# Altium project Startracker_mainboard.PrjPcb
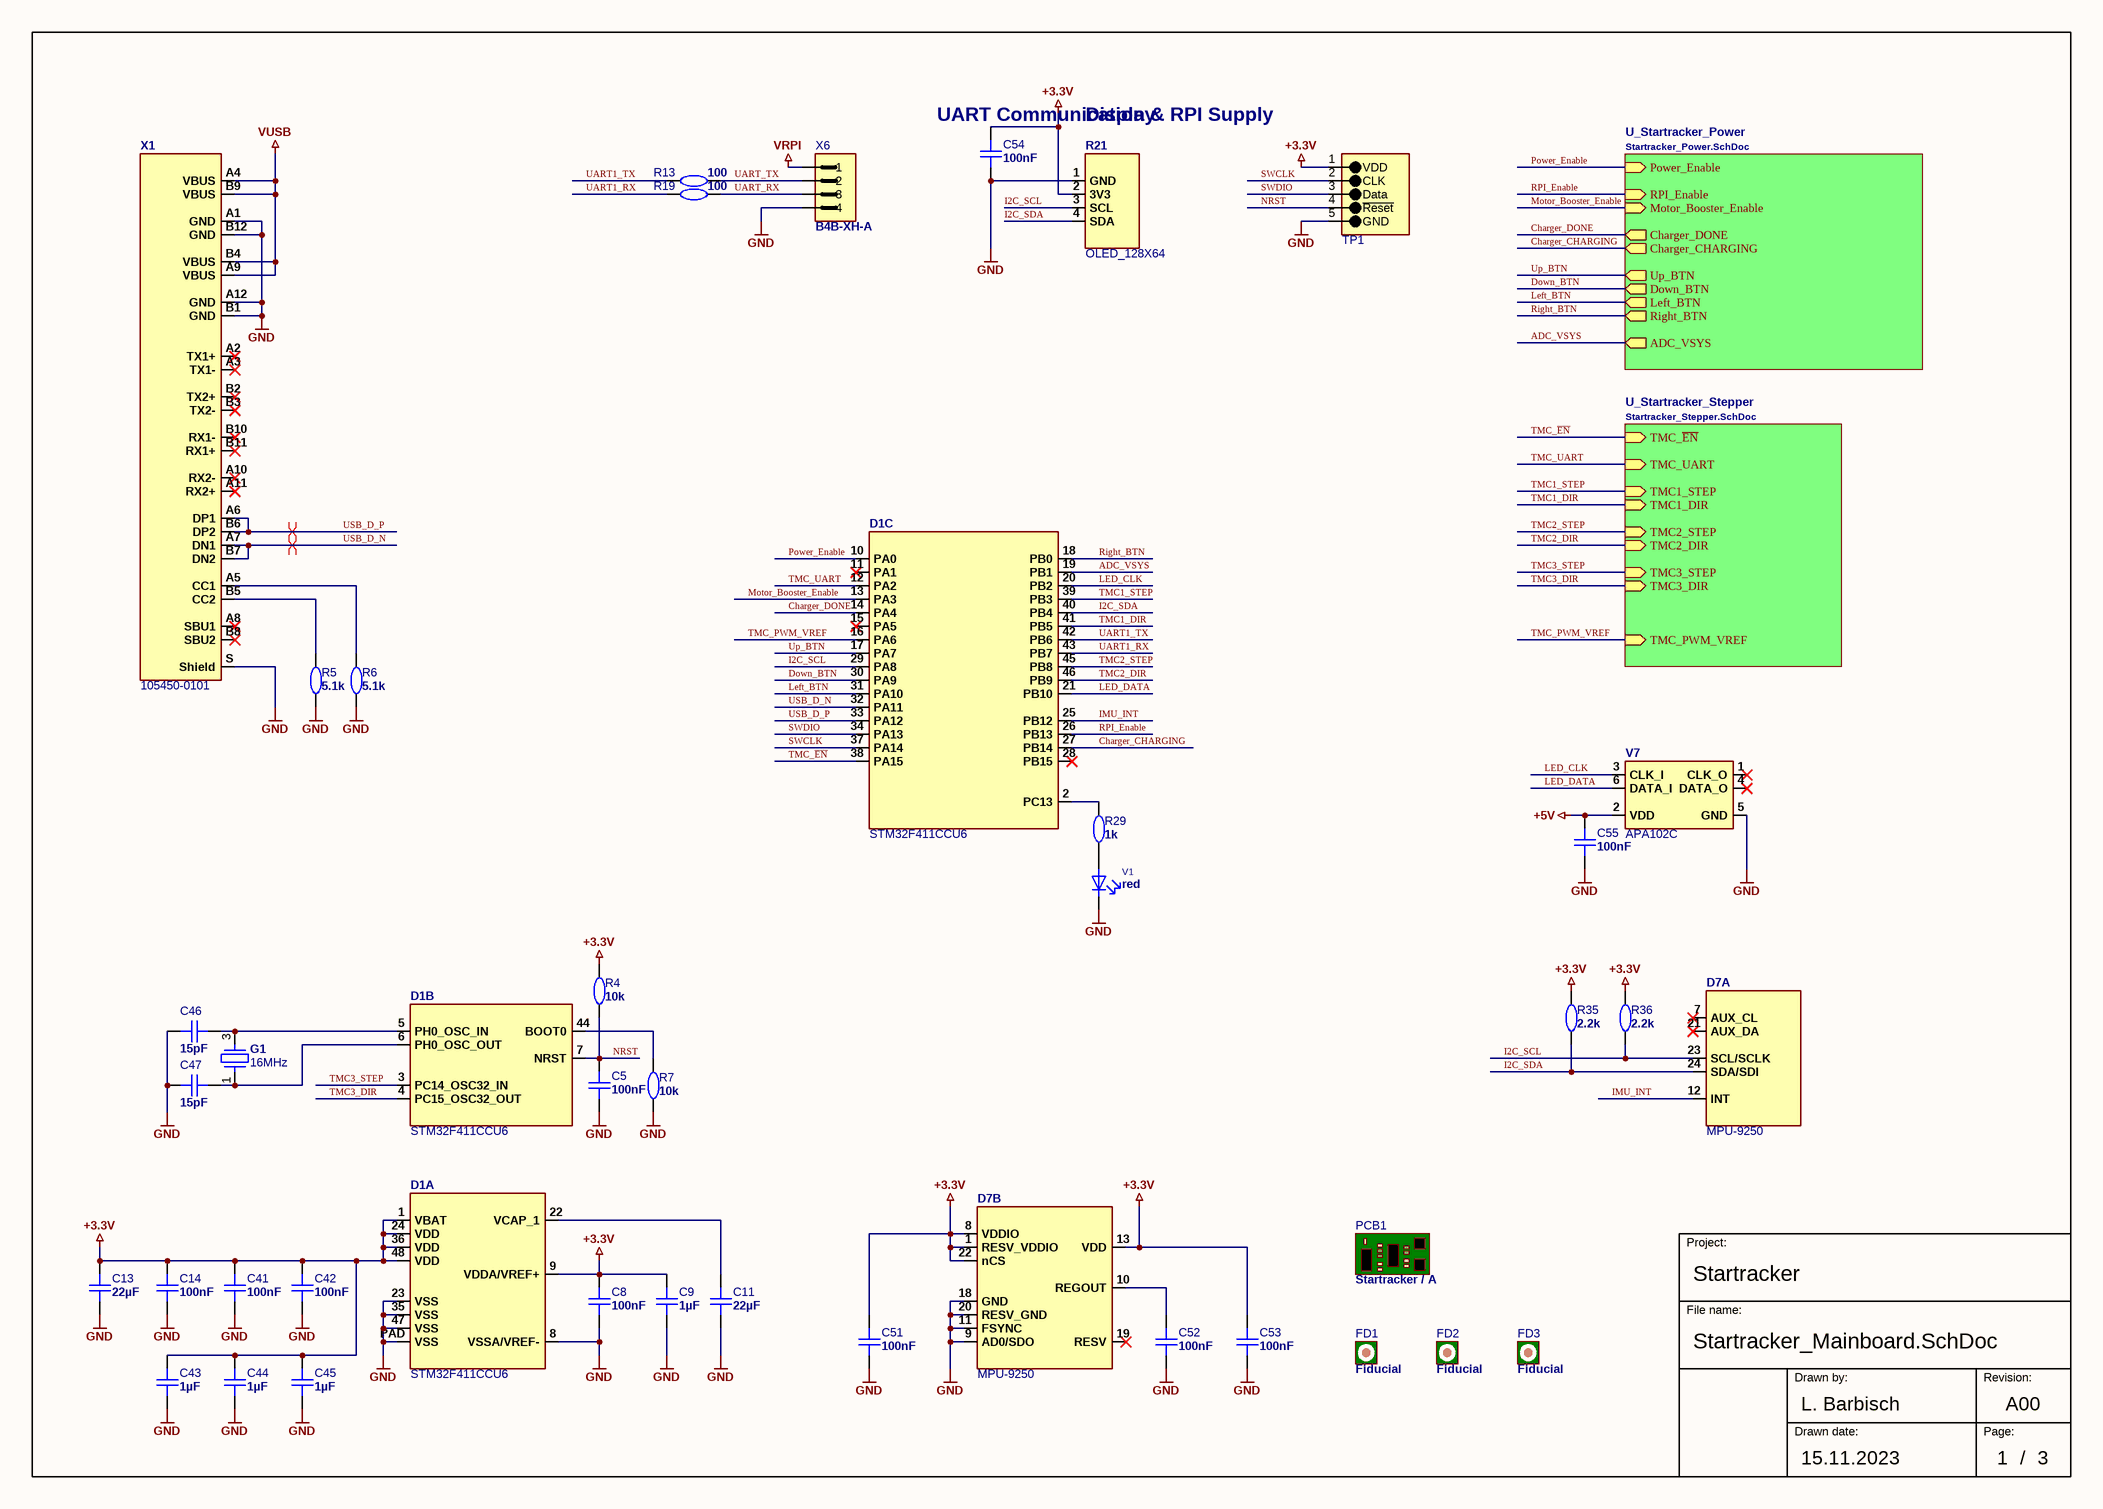
[diagram p0: Startracker_Mainboard.SchDoc]
Schematic_Title: Startracker; Schematic_Revision: A00; Schematic_DrawnDate: 15.11.2023; Schematic_DrawnBy: L. Barbisch; Schematic_DocumentNo: XXXXXXXX; Schematic_CheckedDate: 15.11.2023; Schematic_CheckedBy: L. Barbisch; Revision: A00; Project: Startracker; PCB_TP_Revision: A; PCB_TP_DocumentNo: XXXXXXXX; PCB_Title: Startracker; PCB_Revision: A; PCB_PartNo: XXX.XXXX; PCB_DrawnDate: 15.11.2023; PCB_DrawnBy: L. Barbisch; PCB_CheckedDate: 15.11.2023; PCB_CheckedBy: L. Barbisch; PCB_Assy_DrawnDate: 15.11.2023; PCB_Assy_DrawnBy: L. Barbisch
3 sheets, 126 parts. Net scope: hierarchical (ports join the sheet entries above them; power ports are global).
Board file: Startracker_mainboard.PcbDoc
Sheets:
  Startracker_Mainboard.SchDoc
    U_Startracker_Power = Startracker_Power.SchDoc
    U_Startracker_Stepper = Startracker_Stepper.SchDoc

## Sheet Startracker_Mainboard.SchDoc
size A3; SheetNumber: 1; SheetTotal: 3

### Parts
C5  value 100nF  [C-0603_1608_095_L_RF]  (hidden comment: Cap 100n 0603)
C8  value 100nF  [C-0603_1608_095_L_RF]  (hidden comment: Cap 100n 0603)
C9  value 1µF  [C-0603_1608_095_L_RF]  (hidden comment: Cap 1u 0603)
C11  value 22µF  [C-0603_1608_110_L_RF]  (hidden comment: Cap 22u/ 6.3V 0603)
C13  value 22µF  [C-0603_1608_110_L_RF]  (hidden comment: Cap 22u/ 6.3V 0603)
C14  value 100nF  [C-0603_1608_095_L_RF]  (hidden comment: Cap 100n 0603)
C41  value 100nF  [C-0603_1608_095_L_RF]  (hidden comment: Cap 100n 0603)
C42  value 100nF  [C-0603_1608_095_L_RF]  (hidden comment: Cap 100n 0603)
C43  value 1µF  [C-0603_1608_095_L_RF]  (hidden comment: Cap 1u 0603)
C44  value 1µF  [C-0603_1608_095_L_RF]  (hidden comment: Cap 1u 0603)
C45  value 1µF  [C-0603_1608_095_L_RF]  (hidden comment: Cap 1u 0603)
C46  value 15pF  [C-0603_1608_095_L_RF]  (hidden comment: Cap 15p 0603)
C47  value 15pF  [C-0603_1608_095_L_RF]  (hidden comment: Cap 15p 0603)
C51  value 100nF  [C-0603_1608_095_L_RF]  (hidden comment: Cap 100n 0603)
C52  value 100nF  [C-0603_1608_095_L_RF]  (hidden comment: Cap 100n 0603)
C53  value 100nF  [C-0603_1608_095_L_RF]  (hidden comment: Cap 100n 0603)
C54  value 100nF  [C-0603_1608_095_L_RF]  (hidden comment: Cap 100n 0603)
C55  value 100nF  [C-0603_1608_095_L_RF]  (hidden comment: Cap 100n 0603)
D1  STM32F411CCU6  [UFQFPN48_N_RF]  (parts A,B,C of 3)
D7  MPU-9250  [QFN24_N_RF]  (parts A,B of 2)
FD1  Fiducial  [Fiducial_1.0mm]  (no BOM)
FD2  Fiducial  [Fiducial_1.0mm]  (no BOM)
FD3  Fiducial  [Fiducial_1.0mm]  (no BOM)
G1  16MHz  [G_3225_N_RF]
PCB1  value Startracker / A  [Dummy_PCB-Parameter_SM]  (hidden comment: PCB_Dummy)
R4  value 10k  [R-0603_1608_050_L_RF]  (hidden comment: Res 10k 0603)
R5  value 5.1k  [R-0603_1608_050_L_RF]  (hidden comment: Res 5k1 0603)
R6  value 5.1k  [R-0603_1608_050_L_RF]  (hidden comment: Res 5k1 0603)
R7  value 10k  [R-0603_1608_050_L_RF]  (hidden comment: Res 10k 0603)
R13  value 100  [R-0603_1608_050_L_RF]  (hidden comment: Res 100R 0603)
R19  value 100  [R-0603_1608_050_L_RF]  (hidden comment: Res 100R 0603)
R21  OLED_128X64  [OLED_0.96]
R29  value 1k  [R-0603_1608_050_L_RF]  (hidden comment: Res 1k 0603)
R35  value 2.2k  [R-0603_1608_050_L_RF]  (hidden comment: Res 2k2 0603)
R36  value 2.2k  [R-0603_1608_050_L_RF]  (hidden comment: Res 2k2 0603)
TP1  Programming Interface 5P  [TP_ProgrammingInterface_5P_A]  (value not drawn)  (no BOM)
V1  value red  [LED-0603_1608_Red_L_RF]  (hidden comment: LED SMD 0603 Red)
V7  APA102C  [V_2020_P6_N_RF]
X1  105450-0101  [105450-0101]
X6  value B4B-XH-A  [X-0124X0057-R_M04_P0250_JST_B4B-XH-A]  (hidden comment: CONN HEADER XH 4POS THT)

### Sub-sheets
U_Startracker_Power = Startracker_Power.SchDoc: Motor_Booster_Enable (in), Power_Enable (in), RPI_Enable (in), Charger_CHARGING (out), Charger_DONE (out), Up_BTN (out), Left_BTN (out), Right_BTN (out), ADC_VSYS (out), Down_BTN (out)
U_Startracker_Stepper = Startracker_Stepper.SchDoc: TMC_~{EN} (in), TMC1_STEP (in), TMC1_DIR (in), TMC2_STEP (in), TMC2_DIR (in), TMC3_STEP (in), TMC3_DIR (in), TMC_PWM_VREF (in), TMC_UART (in)

### Nets
+3.3V: C8.1 C9.2 C13.2 C14.1 C41.1 C42.1 C43.2 C44.2 C45.2 C51.1 C53.1 C54.1 D1.1(VBAT) D1.9(VDDA/VREF+) D1.24(VDD) D1.36(VDD) D1.48(VDD) D7.1(RESV_VDDIO) D7.8(VDDIO) D7.13(VDD) D7.22(nCS) R4.2 R21.2(3V3) R35.1 R36.1 TP1.1(VDD)
+5V: C55.1 V7.2(VDD)
GND: C5.2 C8.2 C9.1 C11.1 C13.1 C14.2 C41.2 C42.2 C43.1 C44.1 C45.1 C46.2 C47.2 C51.2 C52.2 C53.2 C54.2 C55.2 D1.8(VSSA/VREF-) D1.23(VSS) D1.35(VSS) D1.47(VSS) D1.PAD(VSS) D7.9(AD0/SDO) D7.11(FSYNC) D7.18(GND) D7.20(RESV_GND) R5.1 R6.1 R7.1 R21.1(GND) TP1.5(GND) V1.2 V7.5(GND) X1.A1(GND) X1.A12(GND) X1.B1(GND) X1.B12(GND) X1.S(Shield) X6.4
VRPI: X6.1
VUSB: X1.A4(VBUS) X1.A9(VBUS) X1.B4(VBUS) X1.B9(VBUS)
ADC_VSYS: D1.19(PB1) ; sheet U_Startracker_Power/ADC_VSYS
Charger_CHARGING: D1.27(PB14) ; sheet U_Startracker_Power/Charger_CHARGING
Charger_DONE: D1.14(PA4) ; sheet U_Startracker_Power/Charger_DONE
Down_BTN: D1.30(PA9) ; sheet U_Startracker_Power/Down_BTN
I2C_SCL: D1.29(PA8) D7.23(SCL/SCLK) R21.3(SCL) R36.2
I2C_SDA: D1.40(PB4) D7.24(SDA/SDI) R21.4(SDA) R35.2
IMU_INT: D1.25(PB12) D7.12(INT)
LED_CLK: D1.20(PB2) V7.3(CLK_I)
LED_DATA: D1.21(PB10) V7.6(DATA_I)
Left_BTN: D1.31(PA10) ; sheet U_Startracker_Power/Left_BTN
Motor_Booster_Enable: D1.13(PA3) ; sheet U_Startracker_Power/Motor_Booster_Enable
NRST: C5.1 D1.7(NRST) R4.1 TP1.4(~{Reset})
Power_Enable: D1.10(PA0) ; sheet U_Startracker_Power/Power_Enable
Right_BTN: D1.18(PB0) ; sheet U_Startracker_Power/Right_BTN
RPI_Enable: D1.26(PB13) ; sheet U_Startracker_Power/RPI_Enable
SWCLK: D1.37(PA14) TP1.2(CLK)
SWDIO: D1.34(PA13) TP1.3(Data)
TMC1_DIR: D1.41(PB5) ; sheet U_Startracker_Stepper/TMC1_DIR
TMC1_STEP: D1.39(PB3) ; sheet U_Startracker_Stepper/TMC1_STEP
TMC2_DIR: D1.46(PB9) ; sheet U_Startracker_Stepper/TMC2_DIR
TMC2_STEP: D1.45(PB8) ; sheet U_Startracker_Stepper/TMC2_STEP
TMC3_DIR: D1.4(PC15_OSC32_OUT) ; sheet U_Startracker_Stepper/TMC3_DIR
TMC3_STEP: D1.3(PC14_OSC32_IN) ; sheet U_Startracker_Stepper/TMC3_STEP
TMC_~{EN}: D1.38(PA15) ; sheet U_Startracker_Stepper/TMC_~{EN}
TMC_PWM_VREF: D1.16(PA6) ; sheet U_Startracker_Stepper/TMC_PWM_VREF
TMC_UART: D1.12(PA2) ; sheet U_Startracker_Stepper/TMC_UART
UART1_RX: D1.43(PB7) R19.1
UART1_TX: D1.42(PB6) R13.1
UART_RX: R19.2 X6.3
UART_TX: R13.2 X6.2
Up_BTN: D1.17(PA7) ; sheet U_Startracker_Power/Up_BTN
USB_D_N: D1.32(PA11) X1.A7(DN1) X1.B7(DN2)
USB_D_P: D1.33(PA12) X1.A6(DP1) X1.B6(DP2)
NetC11_2: C11.2 D1.22(VCAP_1)
NetC46_1: C46.1 D1.5(PH0_OSC_IN) G1.3
NetC47_1: C47.1 D1.6(PH0_OSC_OUT) G1.1
NetC52_1: C52.1 D7.10(REGOUT)
NetD1_2: D1.2(PC13) R29.2
NetD1_44: D1.44(BOOT0) R7.2
NetR5_2: R5.2 X1.B5(CC2)
NetR6_2: R6.2 X1.A5(CC1)
NetR29_1: R29.1 V1.1

Not connected (* = marked no-connect by the designer): D1 11(PA1)* 15(PA5)* 28(PB15)*; D7 7(AUX_CL)* 19(RESV)* 21(AUX_DA)*; V7 1(CLK_O)* 4(DATA_O)*; X1 A2(TX1+)* A3(TX1-)* A8(SBU1)* A10(RX2-)* A11(RX2+)* B2(TX2+)* B3(TX2-)* B8(SBU2)* B10(RX1-)* B11(RX1+)*

### Layout directives
differential pair; differential pair class USB: USB_D_N, USB_D_P

### Notes on the sheet
- UART Communication & RPI Supply
- Display
- Project:
- File name:
- Drawn by:
- Revision:
- Drawn date:
- Page:
- /

### Library data of the parts
C5 C8 C14 C41 C42 C51-C55 = CMP-001-0037-3: Cap Cer SMD 100n 50V 10% 0603 X7R; Manufacturer: KEMET; Manufacturer Part Number: C0603C104K5RAC; User: epph; Prefered: true; MNL_Number: 22310507; GPV_Number: 1749.0075; Case / Package: 0603; PartStatus: Release; Technology: SMT; ClassName: Surface_Assy
C9 C43-C45 = CMP-001-0045-2: Cap Cer SMD 1u 16V 10% 0603 X7R; Manufacturer Part Number: 0603YC105KAT*; Manufacturer: AVX; Prefered: true; User: zupa; GPV_Number: 1749.0125; MNL_Number: 22310613; ComponentLink1Description: Datasheet; ClassName: Surface_Assy; PartStatus: Release; Case / Package: 0603; ComponentLink1URL: https://datasheet.ciiva.com/11464/ccog-11464569.pdf; Technology: SMT
C11 C13 = CMP-001-0140-2: Cap Cer SMD 22u 6.3V 20% 0603 X5R; Manufacturer Part Number: C1608X5R0J226M080AC; Manufacturer: TDK; Prefered: false; GPV_Number: 1749.0255; User: zupa; PartStatus: Release; Technology: SMT; ComponentLink1Description: Datasheet; ComponentLink1URL: https://datasheet.ciiva.com/24454/c1608x5r0j226m080ac-24454269.pdf; ClassName: Surface_Assy; Case / Package: 0603
C46 C47 = CMP-001-0043-2: Cap Cer SMD 15p 50V 5% 0603 C0G; Manufacturer: AVX; Manufacturer Part Number: 06035A150JAT*; Prefered: true; User: zupa; GPV_Number: 1749.0057; Case / Package: 0603; ClassName: Surface_Assy; PartStatus: Release; Technology: SMT; ComponentLink1Description: Datasheet; ComponentLink1URL: https://datasheet.ciiva.com/11464/ccog-11464569.pdf
D1 = STM32F411CCU6: IC MCU Cortex-M4 256k Flash 128k RAM; Part_validated: No; Manufacturer: ST Microelectronics; GPV_Number: xxxx.xxxx; MNL_Number: xxxxxxxx; Value: STM32F411CCU6; Footprint_validated: No; PartStatus: New; System: -; ClassName: Surface_Assy; Case/Package: UFQFPN48; Technology: SMT; Manufacturer Part Number: STM32F411CCU6
D7 = MPU-9250: IC IMU 9-Axis Attitude Sensor; Part_validated: No; Manufacturer: InvenSense; GPV_Number: xxxx.xxxx; MNL_Number: xxxxxxxx; Value: MPU-9250; Footprint_validated: No; PartStatus: New; System: -; ClassName: Surface_Assy; Case/Package: QFN24; Technology: SMT; Manufacturer Part Number: MPU-9250
FD1-FD3 = CMP-001-1312-3: Fiducial Mark; User: balu; PartStatus: Release; Value: Fiducial; ClassName: Symbol; Technology: SYM
G1 = X322516MMB4SI: Crystal Oscillator 16MHz 10pF ±10ppm LCSC C112972; Part_validated: No; Manufacturer: Yangwing Tech; GPV_Number: xxxx.xxxx; MNL_Number: xxxxxxxx; Value: 16MHz; Footprint_validated: No; PartStatus: New; System: -; ClassName: Surface_Assy; Case/Package: 2532; Technology: SMT; Manufacturer Part Number: X322516MMB4SI
PCB1 = CMP-001-1147-5: <PCB DesignName Revision>; User: balu; GPV_Number: XXX.XXXX; ClassName: Symbol; Technology: SYM; PartStatus: Release
R4 R7 = CMP-001-0241-3: Res SMD 10k 1% 0.1W 0603; Manufacturer: YAGEO; Manufacturer Part Number: RC0603FR-0710KL; MNL_Number: 15310022; GPV_Number: 1922.0100; User: zupa; Prefered: true; Case / Package: 0603; ClassName: Surface_Assy; PartStatus: Release; ComponentLink1URL: https://datasheet.ciiva.com/11808/0900766b80f96399-11808280.pdf; ComponentLink1Description: Datasheet; Technology: SMT
R5 R6 = CMP-001-0582-3: Res SMD 5k1 1% 0.1W 0603; Manufacturer Part Number: RC0603FR-075K1L; Manufacturer: YAGEO; Prefered: true; GPV_Number: 1922.0144; User: napa; Technology: SMT; ComponentLink1URL: https://datasheet.ciiva.com/8895/pyu-rc0603-51-rohs-l-4-8895189.pdf; PartStatus: Release; ClassName: Surface_Assy; ComponentLink1Description: Datasheet; Case / Package: 0603
R13 R19 = CMP-001-0240-3: Res SMD 100R 1% 0.1W 0603; Manufacturer: YAGEO; Manufacturer Part Number: RC0603FR-07100RL; Prefered: true; User: zupa; MNL_Number: 15310004; GPV_Number: 1922.0102; ClassName: Surface_Assy; Case / Package: 0603; ComponentLink1Description: Datasheet; Technology: SMT; ComponentLink1URL: https://datasheet.ciiva.com/11808/0900766b80f96399-11808280.pdf; PartStatus: Release
R21 = Display_0.96: OLED Display I2C 128X64 0.96"; Part_validated: No; GPV_Number: xxxx.xxxx; MNL_Number: xxxxxxxx; Value: OLED_128X64; Footprint_validated: No; PartStatus: New; System: -; Case/Package: 4SIL; Technology: TMT; Manufacturer: *; Manufacturer Part Number: *; ClassName: Through-Hole_Assy
R29 = CMP-001-0250-3: Res SMD 1k 1% 0.1W 0603; Manufacturer: YAGEO; Manufacturer Part Number: RC0603FR-071KL; MNL_Number: 15310012; User: zupa; GPV_Number: 1922.0011; Prefered: true; Technology: SMT; ComponentLink1Description: Datasheet; ClassName: Surface_Assy; ComponentLink1URL: https://datasheet.ciiva.com/11808/0900766b80f96399-11808280.pdf; Case / Package: 0603; PartStatus: Release
R35 R36 = CMP-001-0261-3: Res SMD 2k2 1% 0.1W 0603; Manufacturer: YAGEO; Manufacturer Part Number: RC0603FR-072K2L; Prefered: true; User: zupa; GPV_Number: 1922.1472; ClassName: Surface_Assy; ComponentLink1Description: Datasheet; PartStatus: Release; ComponentLink1URL: https://datasheet.ciiva.com/11808/0900766b80f96399-11808280.pdf; Case / Package: 0603; Technology: SMT
TP1 = CMP-001-1519-1: User: zupa; Value: TP; System: Connector; GPV_Number: -; Technology: SMT; ClassName: Surface_Assy; PartStatus: Release
V1 = CMP-001-1207-6: LED RED LTST-C190KDKT-10A 0603; Manufacturer: Lite-On Inc; GPV_Number: 1602.0727; User: epph; Technology: SMT; Manufacturer Part Number: LTST-C190KDKT-10A; Case / Package: 0603; ClassName: Surface_Assy; PartStatus: Release
V7 = APA102C: RGB LED SPI Interface; Part_validated: No; Manufacturer: APA Electronic CO; Manufacturer Part Number: APA-102-2020-256-8A; GPV_Number: xxxx.xxxx; MNL_Number: xxxxxxxx; Value: APA102C; Footprint_validated: No; PartStatus: New; System: -; ClassName: Surface_Assy; Case/Package: 2020; Technology: SMT
X1 = 105450-0101: CONN USB-C 16pin; Part_validated: No; Manufacturer: Molex; GPV_Number: xxxx.xxxx; System: Connector; MNL_Number: xxxxxxxx; Value: 105450-0101; Footprint_validated: No; PartStatus: New; ClassName: Through-Hole_Assy; Case/Package: USB-C; Technology: SMT; Manufacturer Part Number: 105450-0101
X6 = CMP-00142-3: CONN HEADER  4POS_JST_B4B-XH; Manufacturer: JST; System: Connector; User: balu; GPV_Number: 4401.1048; ClassName: Through-Hole_Assy; Technology: THT; Manufacturer Part Number: B4B-XH-A; PartStatus: Release

## Sheet Startracker_Power.SchDoc
size A3; SheetNumber: 2; SheetTotal: 3
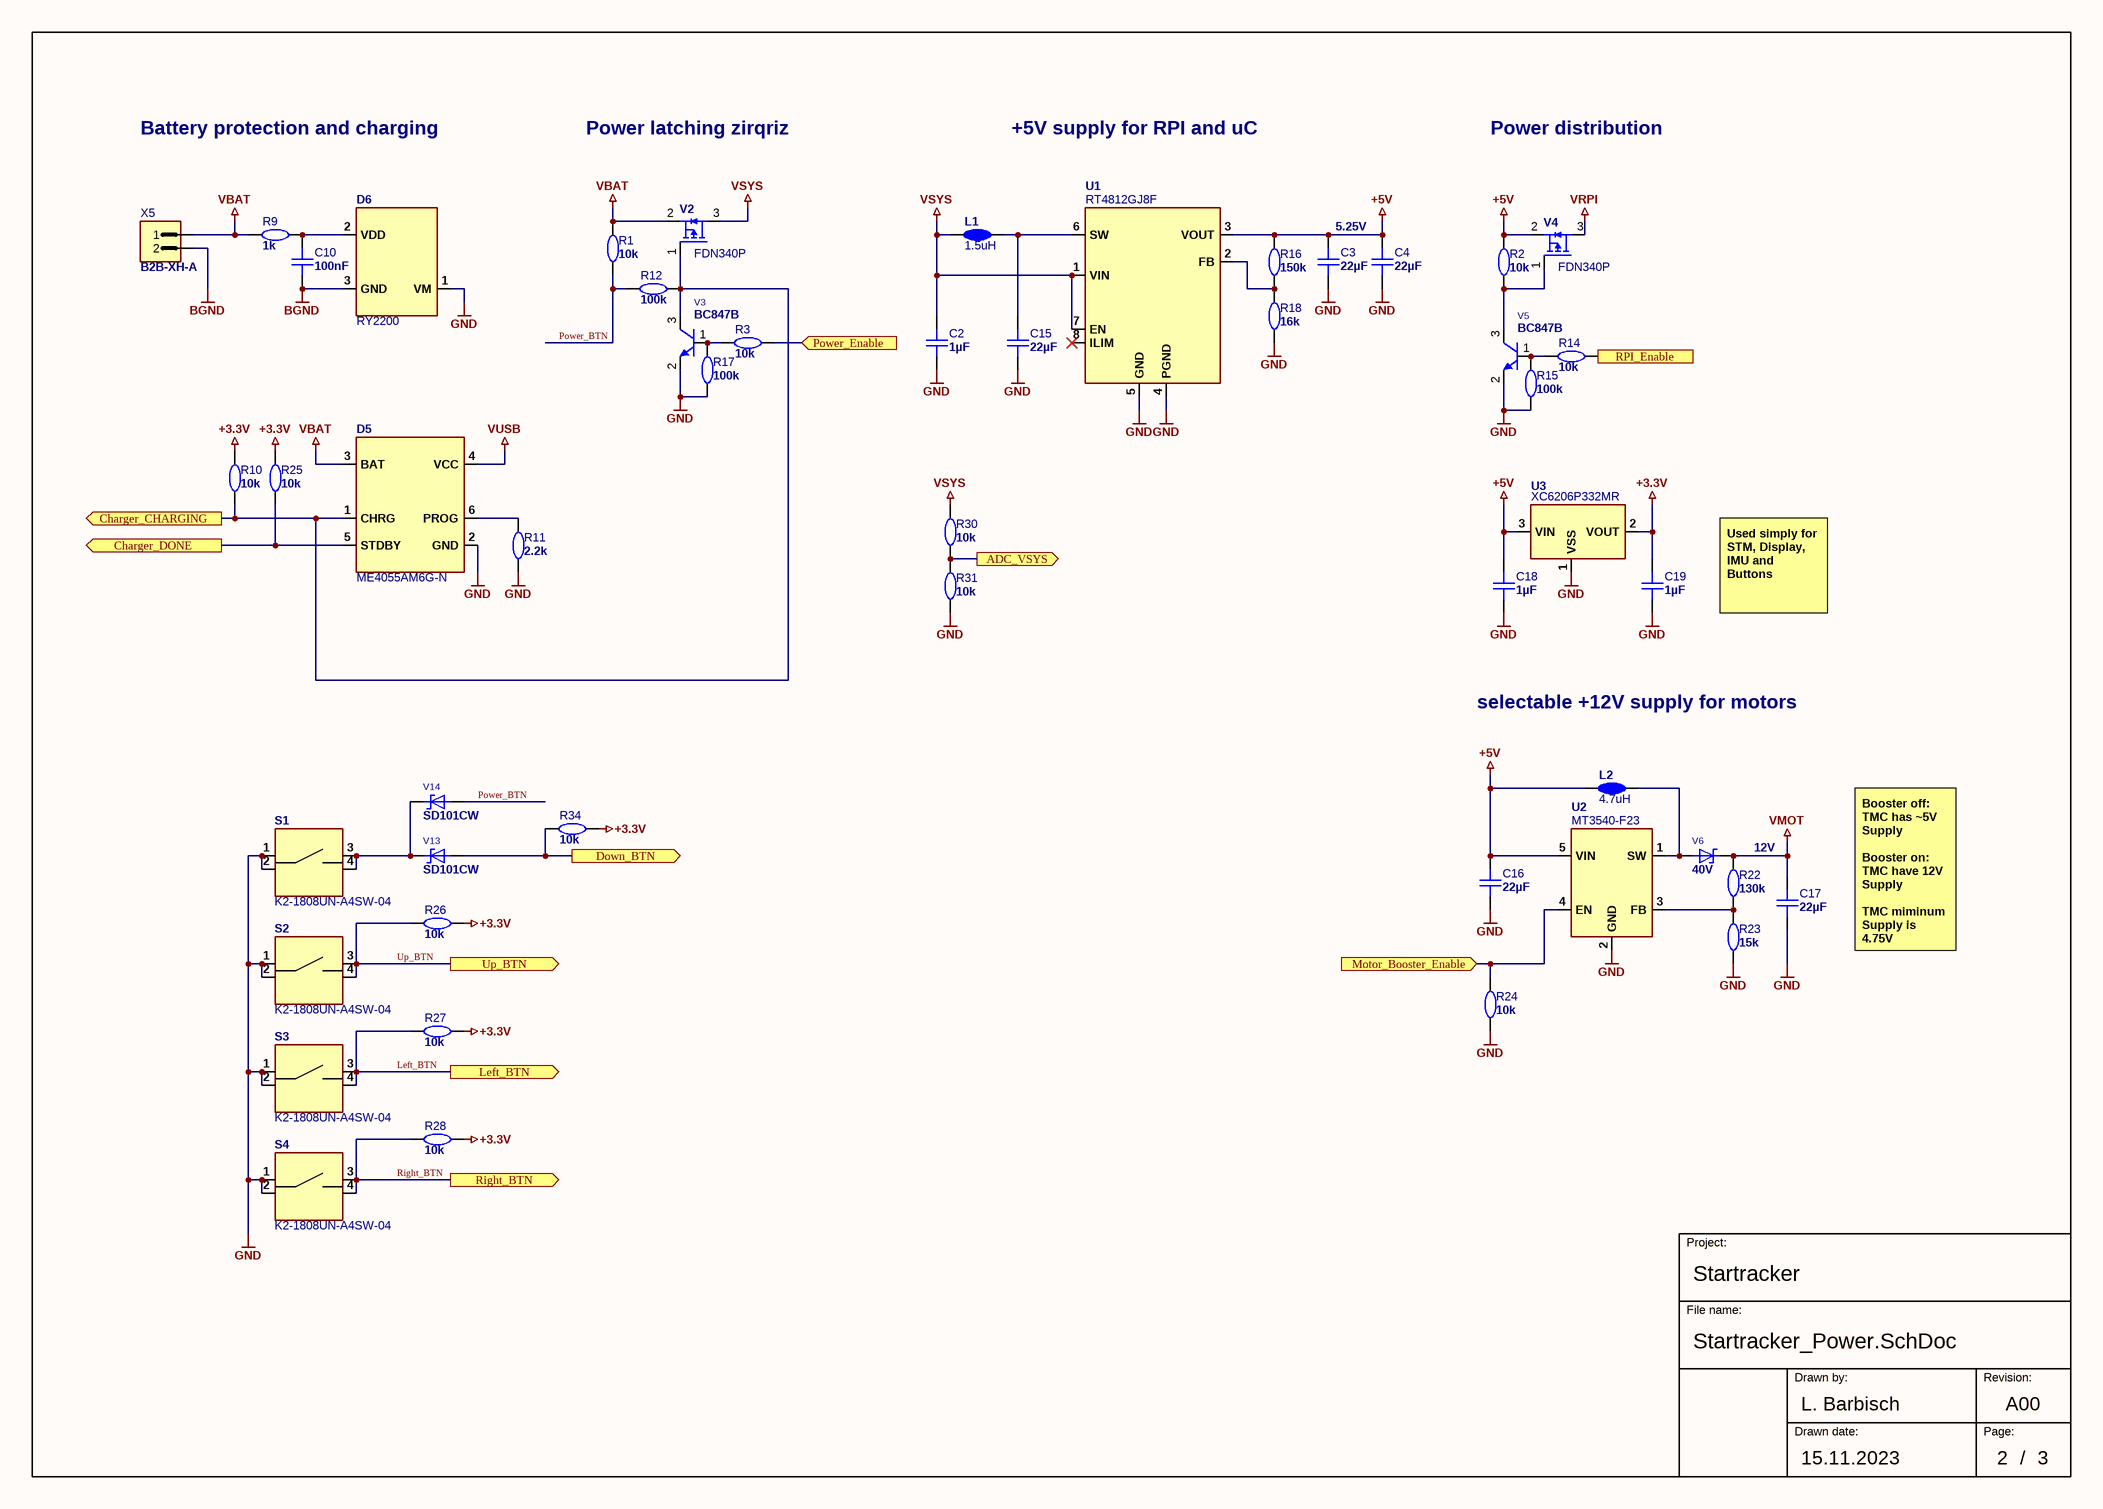
[diagram p1: Startracker_Power.SchDoc]

### Parts
C2  value 1µF  [C-0603_1608_095_L_RF]  (hidden comment: Cap 1u 0603)
C3  value 22µF  [C-1206_3216_230_L_RF]  (hidden comment: Cap 22u 25V 10% 1206)
C4  value 22µF  [C-1206_3216_230_L_RF]  (hidden comment: Cap 22u 25V 10% 1206)
C10  value 100nF  [C-0603_1608_095_L_RF]  (hidden comment: Cap 100n 0603)
C15  value 22µF  [C-1206_3216_230_L_RF]  (hidden comment: Cap 22u 25V 10% 1206)
C16  value 22µF  [C-1206_3216_230_L_RF]  (hidden comment: Cap 22u 25V 10% 1206)
C17  value 22µF  [C-1206_3216_230_L_RF]  (hidden comment: Cap 22u 25V 10% 1206)
C18  value 1µF  [C-0603_1608_095_L_RF]  (hidden comment: Cap 1u 0603)
C19  value 1µF  [C-0603_1608_095_L_RF]  (hidden comment: Cap 1u 0603)
D5  ME4055AM6G-N  [SOT23-6_N_RF]
D6  RY2200  [SOT23_N_RF]
L1  1.5uH  [L-0490X0490_N_RF]
L2  4.7uH  [L-0400X0400_N_RF]
R1  value 10k  [R-0603_1608_050_L_RF]  (hidden comment: Res 10k 0603)
R2  value 10k  [R-0603_1608_050_L_RF]  (hidden comment: Res 10k 0603)
R3  value 10k  [R-0603_1608_050_L_RF]  (hidden comment: Res 10k 0603)
R9  value 1k  [R-0603_1608_050_L_RF]  (hidden comment: Res 1k 0603)
R10  value 10k  [R-0603_1608_050_L_RF]  (hidden comment: Res 10k 0603)
R11  value 2.2k  [R-0603_1608_050_L_RF]  (hidden comment: Res 2k2 0603)
R12  value 100k  [R-0603_1608_050_L_RF]  (hidden comment: Res 100k 0603)
R14  value 10k  [R-0603_1608_050_L_RF]  (hidden comment: Res 10k 0603)
R15  value 100k  [R-0603_1608_050_L_RF]  (hidden comment: Res 100k 0603)
R16  value 150k  [R-0603_1608_050_L_RF]  (hidden comment: Res 150k 0603)
R17  value 100k  [R-0603_1608_050_L_RF]  (hidden comment: Res 100k 0603)
R18  value 16k  [R-0603_1608_050_L_RF]  (hidden comment: Res 16k 0603)
R22  value 130k  [R-0603_1608_050_L_RF]  (hidden comment: Res 130k 0603)
R23  value 15k  [R-0603_1608_050_L_RF]  (hidden comment: Res 15k 0603)
R24  value 10k  [R-0603_1608_050_L_RF]  (hidden comment: Res 10k 0603)
R25  value 10k  [R-0603_1608_050_L_RF]  (hidden comment: Res 10k 0603)
R26  value 10k  [R-0603_1608_050_L_RF]  (hidden comment: Res 10k 0603)
R27  value 10k  [R-0603_1608_050_L_RF]  (hidden comment: Res 10k 0603)
R28  value 10k  [R-0603_1608_050_L_RF]  (hidden comment: Res 10k 0603)
R30  value 10k  [R-0603_1608_050_L_RF]  (hidden comment: Res 10k 0603)
R31  value 10k  [R-0603_1608_050_L_RF]  (hidden comment: Res 10k 0603)
R34  value 10k  [R-0603_1608_050_L_RF]  (hidden comment: Res 10k 0603)
S1  K2-1808UN-A4SW-04  [K2-1808UN-A4SW-04]
S2  K2-1808UN-A4SW-04  [K2-1808UN-A4SW-04]
S3  K2-1808UN-A4SW-04  [K2-1808UN-A4SW-04]
S4  K2-1808UN-A4SW-04  [K2-1808UN-A4SW-04]
U1  RT4812GJ8F  [TSOT-23-8]
U2  MT3540-F23  [SOT23-5_N_RF]
U3  XC6206P332MR  [SOT23_N_RF]
V2  FDN340P  [SOT23_N_RF]
V3  BC847B  [SOT23_L_RF]
V4  FDN340P  [SOT23_N_RF]
V5  BC847B  [SOT23_L_RF]
V6  value 40V  [SMA_DO214AC_L_RF]  (hidden comment: SS14-E3)
V13  value SD101CW  [SOD123_L_RF]  (hidden comment: SD101CW-E3-08)
V14  value SD101CW  [SOD123_L_RF]  (hidden comment: SD101CW-E3-08)
X5  value B2B-XH-A  [X-0074X0057-R_M02_P0250_JST_B2B-XH-A]  (hidden comment: CONN HEADER XH 2POS THT)

### Ports
ADC_VSYS (out), Charger_CHARGING (out), Charger_DONE (out), Down_BTN (out), Left_BTN (out), Motor_Booster_Enable (in), Power_Enable (in), Right_BTN (out), RPI_Enable (in), Up_BTN (out)

### Nets
+3.3V: C19.2 R10.2 R25.2 R26.2 R27.2 R28.2 R34.2 U3.2(VOUT)
+5V: C3.2 C4.2 C16.2 C18.2 L2.1 R2.2 R16.2 U1.3(VOUT) U2.5(VIN) U3.3(VIN) V4.2(S)
BGND: C10.1 D6.3(GND) X5.2
GND: C2.1 C3.1 C4.1 C15.1 C16.1 C17.1 C18.1 C19.1 D5.2(GND) D6.1(VM) R11.1 R15.1 R17.1 R18.1 R23.1 R24.2 R31.1 S1.1 S1.2 S2.1 S2.2 S3.1 S3.2 S4.1 S4.2 U1.4(PGND) U1.5(GND) U2.2(GND) U3.1(VSS) V3.2(E) V5.2(E)
VBAT: D5.3(BAT) R1.2 R9.1 V2.2(S) X5.1
VMOT: C17.2 R22.2 V6.2
VRPI: V4.3(D)
VSYS: C2.2 L1.1 R30.2 U1.1(VIN) U1.7(EN) V2.3(D)
VUSB: D5.4(VCC)
ADC_VSYS: R30.1 R31.2 ; port ADC_VSYS
Charger_CHARGING: D5.1(CHRG) R10.1 R12.1 V2.1(G) V3.3(C) ; port Charger_CHARGING
Charger_DONE: D5.5(STDBY) R25.1 ; port Charger_DONE
Down_BTN: R34.1 V13.1 ; port Down_BTN
Left_BTN: R27.1 S3.3 S3.4 ; port Left_BTN
Motor_Booster_Enable: R24.1 U2.4(EN) ; port Motor_Booster_Enable
Power_BTN: R1.1 R12.2 V14.1
Power_Enable: R3.2 ; port Power_Enable
Right_BTN: R28.1 S4.3 S4.4 ; port Right_BTN
RPI_Enable: R14.2 ; port RPI_Enable
Up_BTN: R26.1 S2.3 S2.4 ; port Up_BTN
NetC10_2: C10.2 D6.2(VDD) R9.2
NetC15_2: C15.2 L1.2 U1.6(SW)
NetD5_6: D5.6(PROG) R11.2
NetL2_2: L2.2 U2.1(SW) V6.1
NetR2_1: R2.1 V4.1(G) V5.3(C)
NetR3_1: R3.1 R17.2 V3.1(B)
NetR14_1: R14.1 R15.2 V5.1(B)
NetR16_1: R16.1 R18.2 U1.2(FB)
NetR22_1: R22.1 R23.2 U2.3(FB)
NetS1_3: S1.3 S1.4 V13.2 V14.2

Not connected (* = marked no-connect by the designer): U1 8(ILIM)*

### Notes on the sheet
- Battery protection and charging
- Power latching zirqriz
- +5V supply for RPI and uC
- Power distribution
- 5.25V
- Used simply for STM, Display, IMU and Buttons
- selectable +12V supply for motors
- 12V
- Booster off:
  TMC has ~5V Supply
  Booster on:
  TMC have 12V Supply
  TMC miminum Supply is 4.75V
- Project:
- File name:
- Drawn by:
- Revision:
- Drawn date:
- Page:
- /

### Library data of the parts
C2 C18 C19 = CMP-001-0045-2: as C9 on sheet Startracker_Mainboard; ComponentLink1Description: Datasheet; ClassName: Surface_Assy; PartStatus: Release; Case / Package: 0603; ComponentLink1URL: https://datasheet.ciiva.com/11464/ccog-11464569.pdf; Technology: SMT
C3 C4 C15 C16 = CMP-001-0137-2: Cap Cer SMD 22u 25V 10% 1206 X5R; Manufacturer Part Number: GRM31CR61E226KE15*; Manufacturer: MURATA; Prefered: false; GPV_Number: 1751.0116; User: zupa; PartStatus: Release; Technology: SMT; ComponentLink1Description: Datasheet; ComponentLink1URL: https://datasheet.ciiva.com/3778/100grm31cr61e226ke1523-3778430.pdf; ClassName: Surface_Assy; Case / Package: 1206
C10 = CMP-001-0037-3: as C5 on sheet Startracker_Mainboard; Case / Package: 0603; PartStatus: Release; Technology: SMT; ClassName: Surface_Assy
C17 = CMP-001-0137-2: Cap Cer SMD 22u 25V 10% 1206 X5R; Manufacturer: MURATA; Manufacturer Part Number: GRM31CR61E226KE15*; User: zupa; GPV_Number: 1751.0116; Prefered: false; Technology: SMT; PartStatus: Release; ComponentLink1Description: Datasheet; ComponentLink1URL: https://datasheet.ciiva.com/3778/100grm31cr61e226ke1523-3778430.pdf; Case / Package: 1206; ClassName: Surface_Assy
D5 = ME4055AM6G-N: IC Charger Li-Ion 1Cell; Part_validated: No; Manufacturer: MICRONE; GPV_Number: xxxx.xxxx; MNL_Number: xxxxxxxx; Value: ME4055AM6G-N; Footprint_validated: No; PartStatus: New; System: -; ClassName: Surface_Assy; Case/Package: SOT-23-6; Technology: SMT; Manufacturer Part Number: ME4055AM6G-N
D6 = RY2200: IC Protection Li-Ion; Part_validated: No; Manufacturer: Rychip; GPV_Number: xxxx.xxxx; MNL_Number: xxxxxxxx; Value: RY2200; Footprint_validated: No; PartStatus: New; System: -; Case/Package: SOT23; Technology: SMT; Manufacturer Part Number: RY2200; ClassName: Surface_Assy
L1 = NRS5040T1R5NMGJ: IND 4.7uH 6.4A 4.9x4.9mm; Part_validated: No; Manufacturer: TAIYO YUDEN; GPV_Number: xxxx.xxxx; MNL_Number: xxxxxxxx; Value: 1.5uH; Footprint_validated: No; PartStatus: New; System: -; ClassName: Surface_Assy; Case/Package: 4.9x4.9; Technology: SMT; Manufacturer Part Number: NRS5040T1R5NMGJ
L2 = APSWPA4030S4R7MTF: IND 4.7uH 2.9A 4x4mm; Part_validated: No; Manufacturer: APV; GPV_Number: xxxx.xxxx; MNL_Number: xxxxxxxx; Value: 4.7uH; Footprint_validated: No; PartStatus: New; System: -; ClassName: Surface_Assy; Case/Package: 4x4; Technology: SMT; Manufacturer Part Number: APSWPA4030S4R7MTF
R1-R3 R10 R14 R24-R28 R30 R31 R34 = CMP-001-0241-3: as R4 on sheet Startracker_Mainboard; Case / Package: 0603; ClassName: Surface_Assy; PartStatus: Release; ComponentLink1URL: https://datasheet.ciiva.com/11808/0900766b80f96399-11808280.pdf; ComponentLink1Description: Datasheet; Technology: SMT
R9 = CMP-001-0250-3: as R29 on sheet Startracker_Mainboard; Technology: SMT; ComponentLink1Description: Datasheet; ClassName: Surface_Assy; ComponentLink1URL: https://datasheet.ciiva.com/11808/0900766b80f96399-11808280.pdf; Case / Package: 0603; PartStatus: Release
R11 = CMP-001-0261-3: as R35 on sheet Startracker_Mainboard; ClassName: Surface_Assy; ComponentLink1Description: Datasheet; PartStatus: Release; ComponentLink1URL: https://datasheet.ciiva.com/11808/0900766b80f96399-11808280.pdf; Case / Package: 0603; Technology: SMT
R12 R15 R17 = CMP-001-0607-3: Res SMD 100k 1% 0.1W 0603; Manufacturer: YAGEO; Manufacturer Part Number: RC0603FR-07100KL; User: napa; GPV_Number: 1922.0140; MNL_Number: 15310632; Prefered: true; ComponentLink1Description: Datasheet; Technology: SMT; PartStatus: Release; ComponentLink1URL: https://datasheet.ciiva.com/8895/pyu-rc0603-51-rohs-l-4-8895189.pdf; ClassName: Surface_Assy; Case / Package: 0603
R16 = CMP-001-0611-3: Res SMD 150k 1% 0.1W 0603; Manufacturer: YAGEO; Manufacturer Part Number: RC0603FR-07150KL; GPV_Number: 1922.1023; Prefered: true; User: napa; ClassName: Surface_Assy; PartStatus: Release; ComponentLink1Description: Datasheet; Case / Package: 0603; Technology: SMT; ComponentLink1URL: https://datasheet.ciiva.com/8895/pyu-rc0603-51-rohs-l-4-8895189.pdf
R18 = CMP-001-0592-3: Res SMD 16k 1% 0.1W 0603; Manufacturer: YAGEO; Manufacturer Part Number: RC0603FR-0716KL; User: napa; Prefered: true; GPV_Number: 1922.0079; Technology: SMT; ClassName: Surface_Assy; PartStatus: Release; ComponentLink1URL: https://datasheet.ciiva.com/8895/pyu-rc0603-51-rohs-l-4-8895189.pdf; ComponentLink1Description: Datasheet; Case / Package: 0603
R22 = CMP-001-0610-3: Res SMD 130k 1% 0.1W 0603; Manufacturer Part Number: RT0603FRE07130KL; Manufacturer: YAGEO; GPV_Number: 1922.0505; User: napa; Prefered: true; Technology: SMT; PartStatus: Release; ClassName: Surface_Assy; ComponentLink1Description: Datasheet; ComponentLink1URL: https://datasheet.ciiva.com/7746/1392914-7746698.pdf; Case / Package: 0603
R23 = CMP-001-0247-3: Res SMD 15k 1% 0.1W 0603; Manufacturer: YAGEO; Manufacturer Part Number: RC0603FR-0715KL; GPV_Number: 1922.0034; Prefered: true; User: zupa; PartStatus: Release; ComponentLink1URL: https://datasheet.ciiva.com/11808/0900766b80f96399-11808280.pdf; ComponentLink1Description: Datasheet; Technology: SMT; Case / Package: 0603; ClassName: Surface_Assy
S1-S4 = K2-1808UN-A4SW-04: BUTTON tactile 12V 50mA; Part_validated: No; Manufacturer: HROparts; GPV_Number: xxxx.xxxx; MNL_Number: xxxxxxxx; Value: K2-1808UN-A4SW-04; Footprint_validated: No; PartStatus: New; System: -; ClassName: Surface_Assy; Case/Package: 4pin; Technology: SMT; Manufacturer Part Number: K2-1808UN-A4SW-04
U1 = RT4812GJ8F: IC Boost Converter 1.8V-5.5V to 1.8-5.5V 2.1A; Part_validated: No; Manufacturer: Richtek; GPV_Number: xxxx.xxxx; MNL_Number: xxxxxxxx; Value: RT4812GJ8F; Footprint_validated: No; PartStatus: New; System: -; ClassName: Surface_Assy; Case/Package: TSOT-23-8; Technology: SMT; Manufacturer Part Number: RT4812GJ8F
U2 = MT3540-F23: IC Boost Converter 2.5V-5.5V upto 28V 1.5A; Part_validated: No; Manufacturer: Aerosemi; GPV_Number: xxxx.xxxx; MNL_Number: xxxxxxxx; Value: MT3540-F23; Footprint_validated: No; PartStatus: New; System: -; ClassName: Surface_Assy; Case/Package: SOT23-5; Technology: SMT; Manufacturer Part Number: MT3540-F23
U3 = XC6206P332MR: IC REG LDO 3.3V 200mA; Part_validated: No; Manufacturer: Torex; GPV_Number: xxxx.xxxx; MNL_Number: xxxxxxxx; Value: XC6206P332MR; Footprint_validated: No; PartStatus: New; System: -; ClassName: Surface_Assy; Case/Package: SOT23; Technology: SMT; Manufacturer Part Number: XC6206P332MR
V2 V4 = FDN340P: MOSFET PCH -2A 20V; Part_validated: No; Manufacturer: onsemi; GPV_Number: xxxx.xxxx; MNL_Number: xxxxxxxx; Value: FDN340P; Footprint_validated: No; PartStatus: New; System: -; ClassName: Surface_Assy; Case/Package: SOT-23; Technology: SMT; Manufacturer Part Number: FDN340P
V3 V5 = CMP-001-1243-2: TRANS SMD NPN 45V 0.1A BC847B SOT23; Manufacturer: NXP Semiconductors; Manufacturer Part Number: BC847B/C; User: zupa; GPV_Number: 1601.0512; MNL_Number: 48470200; ClassName: Surface_Assy; Value: BC847B; Technology: SMT; Case / Package: SOT23; PartStatus: Release
V6 = CMP-00074-1: Diode Schottky 40V 1A SMA; Manufacturer: VISHAY; GPV_Number: 1600.1206; User: epph; PartStatus: New; Technology: SMT; Manufacturer Part Number: SS14-E3; ClassName: Surface_Assy; Case / Package: SMA
V13 V14 = CMP-001-1356-2: Diode Schottky  1mA 40 Volt; Manufacturer: VISHAY; User: zupa; Manufacturer Part Number: SD101CW-E3-08; ComponentLink1Description: Datasheet; Case / Package: SOD123; ClassName: Surface_Assy; ComponentLink1URL: https://www.vishay.com/docs/85679/sd101aw.pdf; Technology: SMT; PartStatus: Release
X5 = CMP-00140-3: CONN HEADER  2POS_JST_B2B-XH; Manufacturer: JST; GPV_Number: 4401.1025; User: balu; System: Connector; Manufacturer Part Number: B2B-XH-A; PartStatus: Release; Technology: THT; ClassName: Through-Hole_Assy

## Sheet Startracker_Stepper.SchDoc
size A3; SheetNumber: 3; SheetTotal: 3
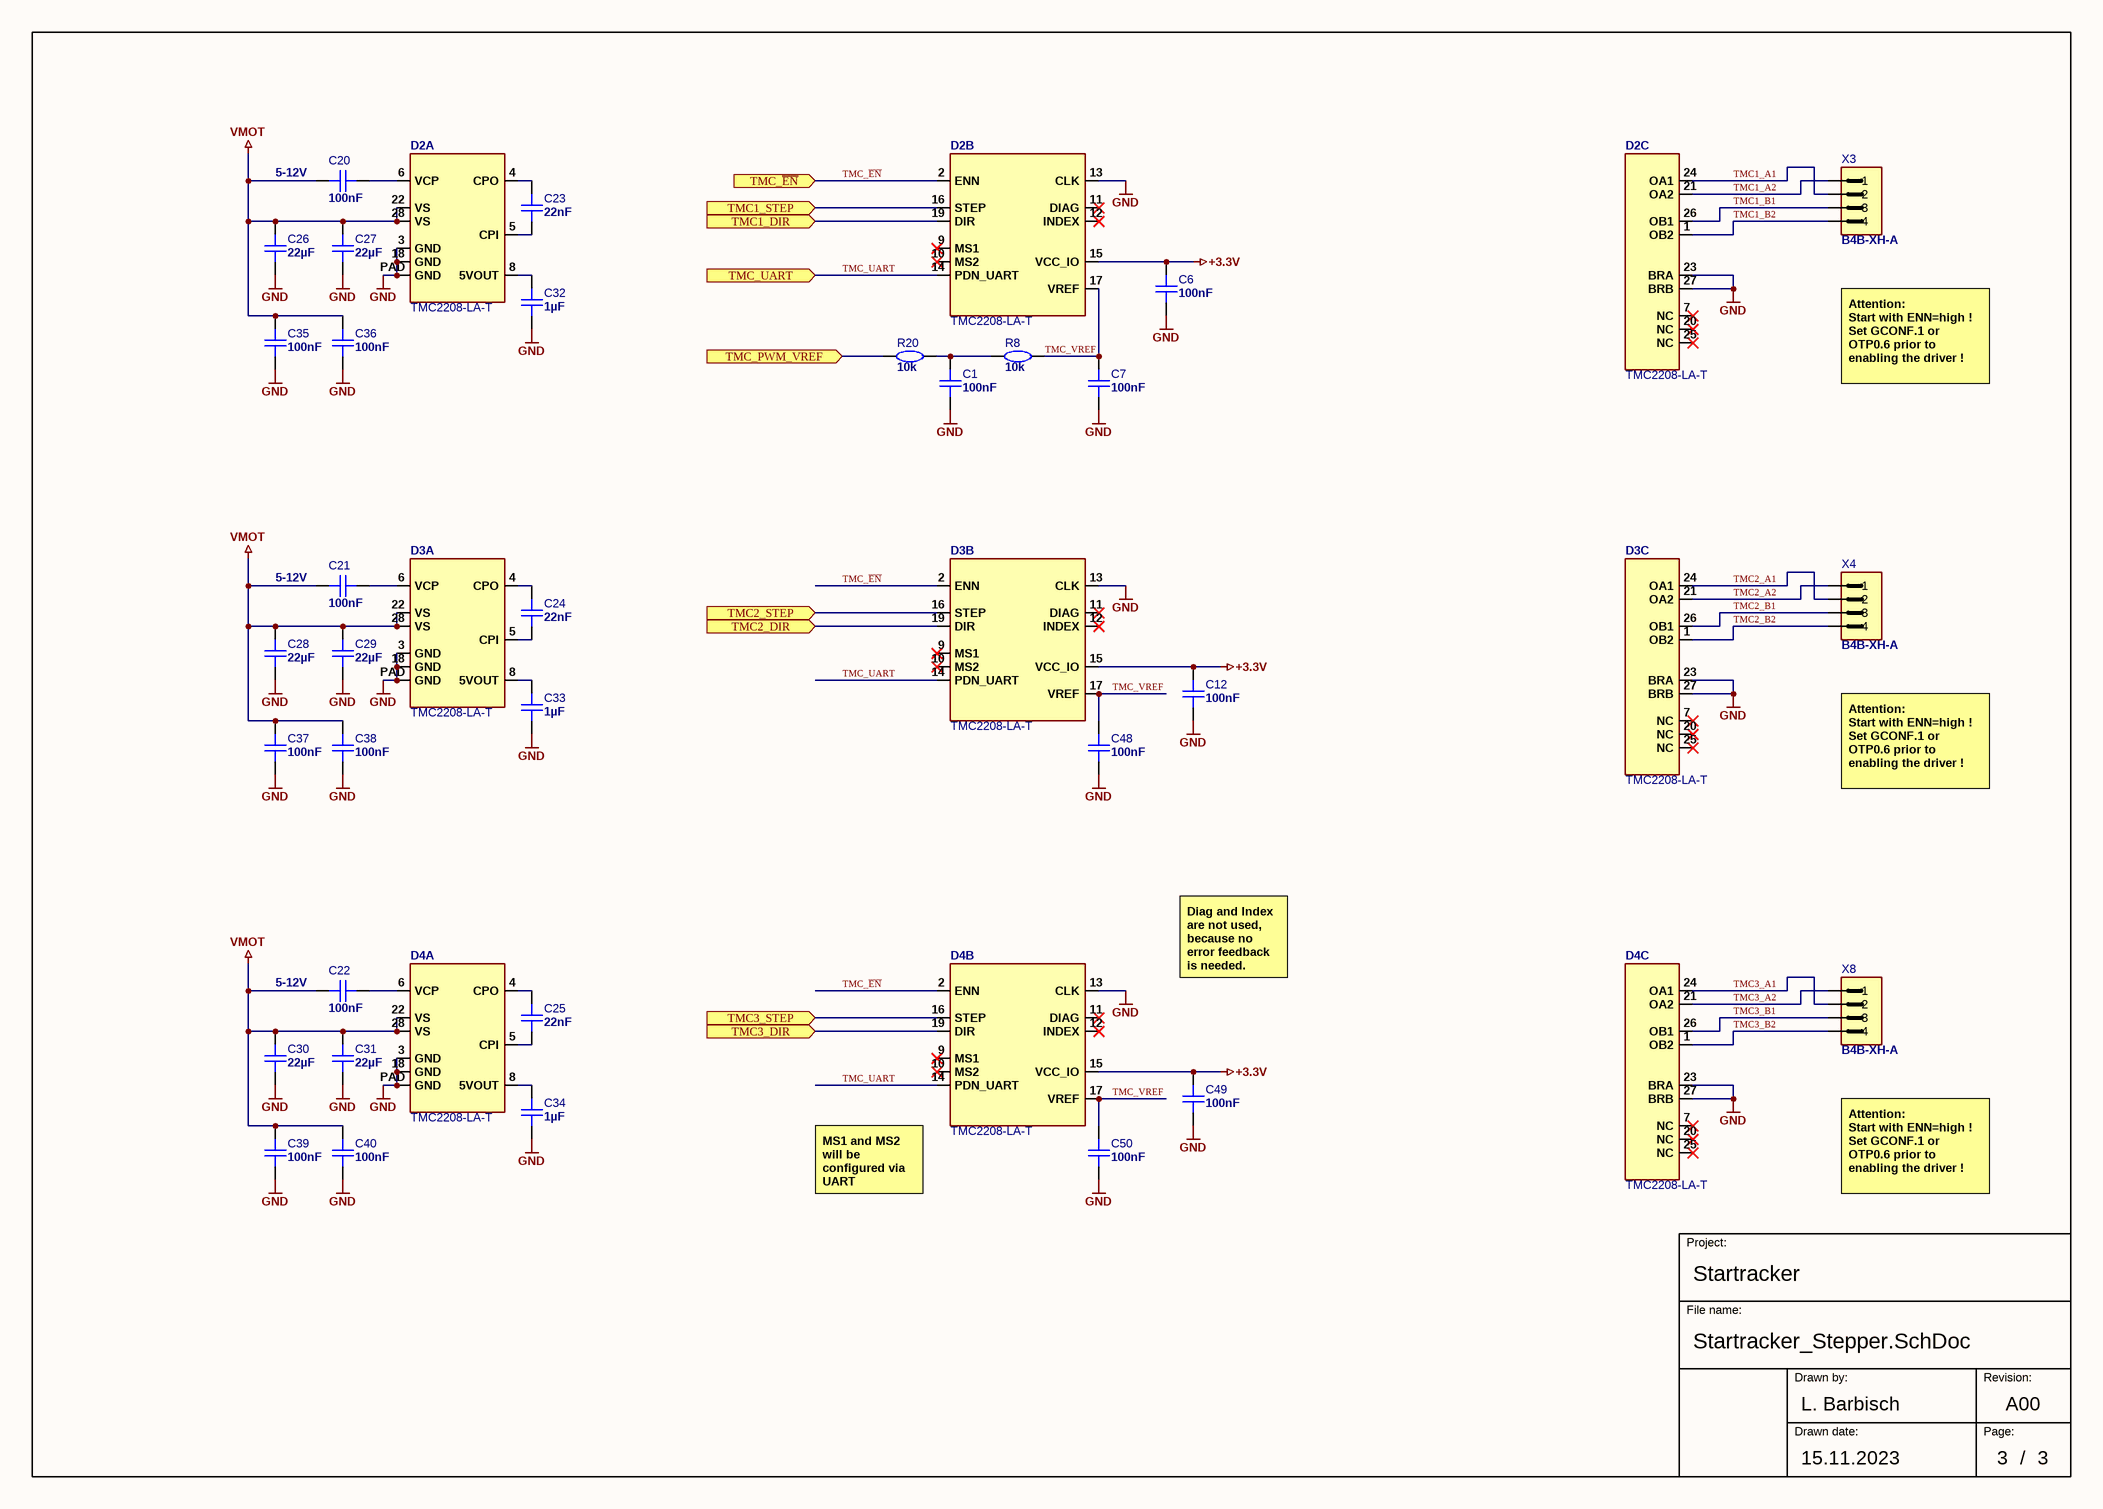
[diagram p2: Startracker_Stepper.SchDoc]

### Parts
C1  value 100nF  [C-0603_1608_095_L_RF]  (hidden comment: Cap 100n 0603)
C6  value 100nF  [C-0603_1608_095_L_RF]  (hidden comment: Cap 100n 0603)
C7  value 100nF  [C-0603_1608_095_L_RF]  (hidden comment: Cap 100n 0603)
C12  value 100nF  [C-0603_1608_095_L_RF]  (hidden comment: Cap 100n 0603)
C20  value 100nF  [C-0603_1608_095_L_RF]  (hidden comment: Cap 100n 0603)
C21  value 100nF  [C-0603_1608_095_L_RF]  (hidden comment: Cap 100n 0603)
C22  value 100nF  [C-0603_1608_095_L_RF]  (hidden comment: Cap 100n 0603)
C23  value 22nF  [C-0603_1608_095_L_RF]  (hidden comment: Cap 22n 0603)
C24  value 22nF  [C-0603_1608_095_L_RF]  (hidden comment: Cap 22n 0603)
C25  value 22nF  [C-0603_1608_095_L_RF]  (hidden comment: Cap 22n 0603)
C26  value 22µF  [C-1206_3216_230_L_RF]  (hidden comment: Cap 22u 25V 10% 1206)
C27  value 22µF  [C-1206_3216_230_L_RF]  (hidden comment: Cap 22u 25V 10% 1206)
C28  value 22µF  [C-1206_3216_230_L_RF]  (hidden comment: Cap 22u 25V 10% 1206)
C29  value 22µF  [C-1206_3216_230_L_RF]  (hidden comment: Cap 22u 25V 10% 1206)
C30  value 22µF  [C-1206_3216_230_L_RF]  (hidden comment: Cap 22u 25V 10% 1206)
C31  value 22µF  [C-1206_3216_230_L_RF]  (hidden comment: Cap 22u 25V 10% 1206)
C32  value 1µF  [C-0603_1608_095_L_RF]  (hidden comment: Cap 1u 0603)
C33  value 1µF  [C-0603_1608_095_L_RF]  (hidden comment: Cap 1u 0603)
C34  value 1µF  [C-0603_1608_095_L_RF]  (hidden comment: Cap 1u 0603)
C35  value 100nF  [C-0603_1608_095_L_RF]  (hidden comment: Cap 100n 0603)
C36  value 100nF  [C-0603_1608_095_L_RF]  (hidden comment: Cap 100n 0603)
C37  value 100nF  [C-0603_1608_095_L_RF]  (hidden comment: Cap 100n 0603)
C38  value 100nF  [C-0603_1608_095_L_RF]  (hidden comment: Cap 100n 0603)
C39  value 100nF  [C-0603_1608_095_L_RF]  (hidden comment: Cap 100n 0603)
C40  value 100nF  [C-0603_1608_095_L_RF]  (hidden comment: Cap 100n 0603)
C48  value 100nF  [C-0603_1608_095_L_RF]  (hidden comment: Cap 100n 0603)
C49  value 100nF  [C-0603_1608_095_L_RF]  (hidden comment: Cap 100n 0603)
C50  value 100nF  [C-0603_1608_095_L_RF]  (hidden comment: Cap 100n 0603)
D2  TMC2208-LA-T  [QFN28_N_RF]  (parts A,B,C of 3)
D3  TMC2208-LA-T  [QFN28_N_RF]  (parts A,B,C of 3)
D4  TMC2208-LA-T  [QFN28_N_RF]  (parts A,B,C of 3)
R8  value 10k  [R-0603_1608_050_L_RF]  (hidden comment: Res 10k 0603)
R20  value 10k  [R-0603_1608_050_L_RF]  (hidden comment: Res 10k 0603)
X3  value B4B-XH-A  [X-0124X0057-R_M04_P0250_JST_B4B-XH-A]  (hidden comment: CONN HEADER XH 4POS THT)
X4  value B4B-XH-A  [X-0124X0057-R_M04_P0250_JST_B4B-XH-A]  (hidden comment: CONN HEADER XH 4POS THT)
X8  value B4B-XH-A  [X-0124X0057-R_M04_P0250_JST_B4B-XH-A]  (hidden comment: CONN HEADER XH 4POS THT)

### Ports
TMC1_DIR (in), TMC1_STEP (in), TMC2_DIR (in), TMC2_STEP (in), TMC3_DIR (in), TMC3_STEP (in), TMC_PWM_VREF (in), TMC_UART (in), TMC_~{EN} (in)

### Nets
+3.3V: C6.1 C12.1 C49.1 D2.15(VCC_IO) D3.15(VCC_IO) D4.15(VCC_IO)
GND: C1.2 C6.2 C7.2 C12.2 C26.1 C27.1 C28.1 C29.1 C30.1 C31.1 C32.1 C33.1 C34.1 C35.1 C36.1 C37.1 C38.1 C39.1 C40.1 C48.2 C49.2 C50.2 D2.3(GND) D2.13(CLK) D2.18(GND) D2.23(BRA) D2.27(BRB) D2.PAD(GND) D3.3(GND) D3.13(CLK) D3.18(GND) D3.23(BRA) D3.27(BRB) D3.PAD(GND) D4.3(GND) D4.13(CLK) D4.18(GND) D4.23(BRA) D4.27(BRB) D4.PAD(GND)
VMOT: C20.2 C21.2 C22.2 C26.2 C27.2 C28.2 C29.2 C30.2 C31.2 C35.2 C36.2 C37.2 C38.2 C39.2 C40.2 D2.22(VS) D2.28(VS) D3.22(VS) D3.28(VS) D4.22(VS) D4.28(VS)
TMC1_A1: D2.24(OA1) X3.2
TMC1_A2: D2.21(OA2) X3.1
TMC1_B1: D2.26(OB1) X3.3
TMC1_B2: D2.1(OB2) X3.4
TMC1_DIR: D2.19(DIR) ; port TMC1_DIR
TMC1_STEP: D2.16(STEP) ; port TMC1_STEP
TMC2_A1: D3.24(OA1) X4.2
TMC2_A2: D3.21(OA2) X4.1
TMC2_B1: D3.26(OB1) X4.3
TMC2_B2: D3.1(OB2) X4.4
TMC2_DIR: D3.19(DIR) ; port TMC2_DIR
TMC2_STEP: D3.16(STEP) ; port TMC2_STEP
TMC3_A1: D4.24(OA1) X8.2
TMC3_A2: D4.21(OA2) X8.1
TMC3_B1: D4.26(OB1) X8.3
TMC3_B2: D4.1(OB2) X8.4
TMC3_DIR: D4.19(DIR) ; port TMC3_DIR
TMC3_STEP: D4.16(STEP) ; port TMC3_STEP
TMC_~{EN}: D2.2(ENN) D3.2(ENN) D4.2(ENN) ; port TMC_~{EN}
TMC_PWM_VREF: R20.1 ; port TMC_PWM_VREF
TMC_UART: D2.14(PDN_UART) D3.14(PDN_UART) D4.14(PDN_UART) ; port TMC_UART
TMC_VREF: C7.1 C48.1 C50.1 D2.17(VREF) D3.17(VREF) D4.17(VREF) R8.2
NetC1_1: C1.1 R8.1 R20.2
NetC20_1: C20.1 D2.6(VCP)
NetC21_1: C21.1 D3.6(VCP)
NetC22_1: C22.1 D4.6(VCP)
NetC23_1: C23.1 D2.5(CPI)
NetC23_2: C23.2 D2.4(CPO)
NetC24_1: C24.1 D3.5(CPI)
NetC24_2: C24.2 D3.4(CPO)
NetC25_1: C25.1 D4.5(CPI)
NetC25_2: C25.2 D4.4(CPO)
NetC32_2: C32.2 D2.8(5VOUT)
NetC33_2: C33.2 D3.8(5VOUT)
NetC34_2: C34.2 D4.8(5VOUT)

Not connected (* = marked no-connect by the designer): D2 7(NC)* 9(MS1)* 10(MS2)* 11(DIAG)* 12(INDEX)* 20(NC)* 25(NC)*; D3 7(NC)* 9(MS1)* 10(MS2)* 11(DIAG)* 12(INDEX)* 20(NC)* 25(NC)*; D4 7(NC)* 9(MS1)* 10(MS2)* 11(DIAG)* 12(INDEX)* 20(NC)* 25(NC)*

### Notes on the sheet
- (near C20) 5-12V
- Attention:
  Start with ENN=high !
  Set GCONF.1 or OTP0.6 prior to enabling the driver !
- (near C21) 5-12V
- (near C22) 5-12V
- Diag and Index are not used, because no error feedback is needed.
- (near D4) MS1 and MS2 will be configured via UART
- Project:
- File name:
- Drawn by:
- Revision:
- Drawn date:
- Page:
- /

### Library data of the parts
C1 C6 C7 C12 C20-C22 C35-C40 C48-C50 = CMP-001-0037-3: as C5 on sheet Startracker_Mainboard; Case / Package: 0603; PartStatus: Release; Technology: SMT; ClassName: Surface_Assy
C23-C25 = CMP-001-0047-2: Cap Cer SMD 22n 50V 10% 0603 X7R; Manufacturer Part Number: 06035C223KAT*; Manufacturer: AVX; GPV_Number: 1749.0099; Prefered: true; User: zupa; PartStatus: Release; ComponentLink1Description: Datasheet; ComponentLink1URL: https://datasheet.ciiva.com/11464/ccog-11464569.pdf; ClassName: Surface_Assy; Technology: SMT; Case / Package: 0603
C26-C31 = CMP-001-0137-2: as C3 on sheet Startracker_Power; PartStatus: Release; Technology: SMT; ComponentLink1Description: Datasheet; ComponentLink1URL: https://datasheet.ciiva.com/3778/100grm31cr61e226ke1523-3778430.pdf; ClassName: Surface_Assy; Case / Package: 1206
C32-C34 = CMP-001-0045-2: as C9 on sheet Startracker_Mainboard; ComponentLink1Description: Datasheet; ClassName: Surface_Assy; PartStatus: Release; Case / Package: 0603; ComponentLink1URL: https://datasheet.ciiva.com/11464/ccog-11464569.pdf; Technology: SMT
D2-D4 = TMC2208-LA-T: IC DRIVER Stepper 1.4A; Part_validated: No; Manufacturer: Analog Devices; GPV_Number: xxxx.xxxx; MNL_Number: xxxxxxxx; Value: TMC2208-LA-T; Footprint_validated: No; PartStatus: New; System: -; ClassName: Surface_Assy; Case/Package: QFN28; Technology: SMT; Manufacturer Part Number: TMC2208-LA-T
R8 R20 = CMP-001-0241-3: as R4 on sheet Startracker_Mainboard; Case / Package: 0603; ClassName: Surface_Assy; PartStatus: Release; ComponentLink1URL: https://datasheet.ciiva.com/11808/0900766b80f96399-11808280.pdf; ComponentLink1Description: Datasheet; Technology: SMT
X3 X4 X8 = CMP-00142-3: as X6 on sheet Startracker_Mainboard; ClassName: Through-Hole_Assy; Technology: THT; Manufacturer Part Number: B4B-XH-A; PartStatus: Release

## Nets that join several sheets
+3.3V: Startracker_Mainboard (26 pins), Startracker_Power (8 pins), Startracker_Stepper (6 pins)
+5V: Startracker_Mainboard (C55.1 V7.2), Startracker_Power (11 pins)
GND: Startracker_Mainboard (40 pins), Startracker_Power (31 pins), Startracker_Stepper (40 pins)
VMOT: Startracker_Power (C17.2 R22.2 V6.2), Startracker_Stepper (21 pins)
VRPI: Startracker_Mainboard (X6.1), Startracker_Power (V4.3)
VUSB: Startracker_Mainboard (X1.A4 X1.A9 X1.B4 X1.B9), Startracker_Power (D5.4)
ADC_VSYS: Startracker_Mainboard (D1.19), Startracker_Power (R30.1 R31.2)
Charger_CHARGING: Startracker_Mainboard (D1.27), Startracker_Power (5 pins)
Charger_DONE: Startracker_Mainboard (D1.14), Startracker_Power (D5.5 R25.1)
Down_BTN: Startracker_Mainboard (D1.30), Startracker_Power (R34.1 V13.1)
Left_BTN: Startracker_Mainboard (D1.31), Startracker_Power (R27.1 S3.3 S3.4)
Motor_Booster_Enable: Startracker_Mainboard (D1.13), Startracker_Power (R24.1 U2.4)
Power_Enable: Startracker_Mainboard (D1.10), Startracker_Power (R3.2)
Right_BTN: Startracker_Mainboard (D1.18), Startracker_Power (R28.1 S4.3 S4.4)
RPI_Enable: Startracker_Mainboard (D1.26), Startracker_Power (R14.2)
TMC1_DIR: Startracker_Mainboard (D1.41), Startracker_Stepper (D2.19)
TMC1_STEP: Startracker_Mainboard (D1.39), Startracker_Stepper (D2.16)
TMC2_DIR: Startracker_Mainboard (D1.46), Startracker_Stepper (D3.19)
TMC2_STEP: Startracker_Mainboard (D1.45), Startracker_Stepper (D3.16)
TMC3_DIR: Startracker_Mainboard (D1.4), Startracker_Stepper (D4.19)
TMC3_STEP: Startracker_Mainboard (D1.3), Startracker_Stepper (D4.16)
TMC_~{EN}: Startracker_Mainboard (D1.38), Startracker_Stepper (D2.2 D3.2 D4.2)
TMC_PWM_VREF: Startracker_Mainboard (D1.16), Startracker_Stepper (R20.1)
TMC_UART: Startracker_Mainboard (D1.12), Startracker_Stepper (D2.14 D3.14 D4.14)
Up_BTN: Startracker_Mainboard (D1.17), Startracker_Power (R26.1 S2.3 S2.4)

## Assembly variants
Standard: not fitted R31